# Altium schematic sheet МногоИзменений.SchDoc
size 839 x 594 mm; Origin: Eagle; GateName_1: G$1; SymbolName_1: SEEEDSTUDIO-SCH-FRAME-BIG; LibraryName: moudle-new; DeviceSetName: SEEEDSTUDIO-SCH-FRAME-BIG; Sheet: Sheet:; SeeedStudio: Seeed Studio; Design: Design:; Check: Check:; Vision: Vision:; CC-BY-SA: CC-BY-SA; SheetNumber: 1; SheetTotal: 2; PageSetup: Record=PageOptions|CenterHorizontal=True|CenterVertical=True|PrintScale=0.94|XCorrection=1.00|YCorrection=1.00|PrintKind=1|BorderSize=5000000|LeftOffset=0|BottomOffset=0|Orientation=1|PaperLength=1000|PaperWidth=1000|Scale=100|PaperSource=7|PrintQuality=-4|MediaType=1|DitherType=10|PaperKind=A4|PrintScaleMode=1; ГОСТ 1: ГОСТ 2.104-2006 Глава 6, Форма 1; ГОСТ 2: ГОСТ 2.701-2008 Таблица 1, Таблица 2; ГОСТ 3: ГОСТ 2.301-68; ГОСТ 4: ГОСТ 2.302-68; DocumentName: Sheet1.SCHDOC
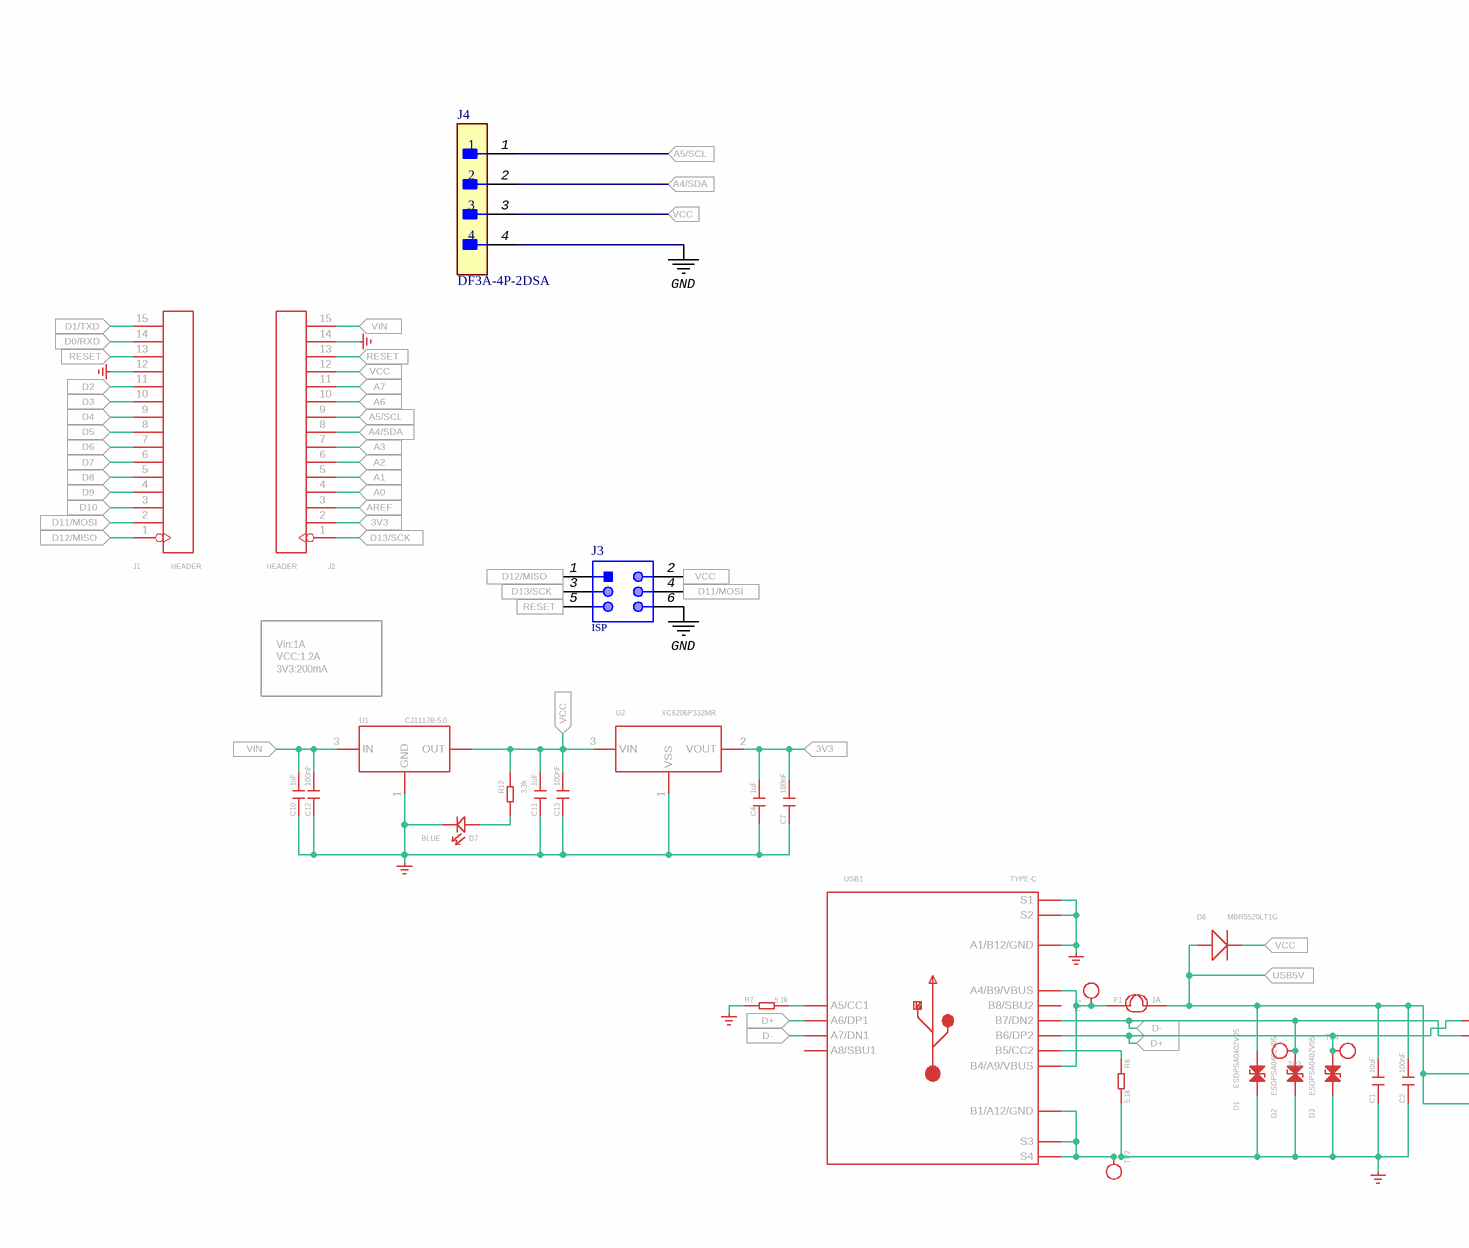
[diagram p0: МногоИзменений.SchDoc, top left]
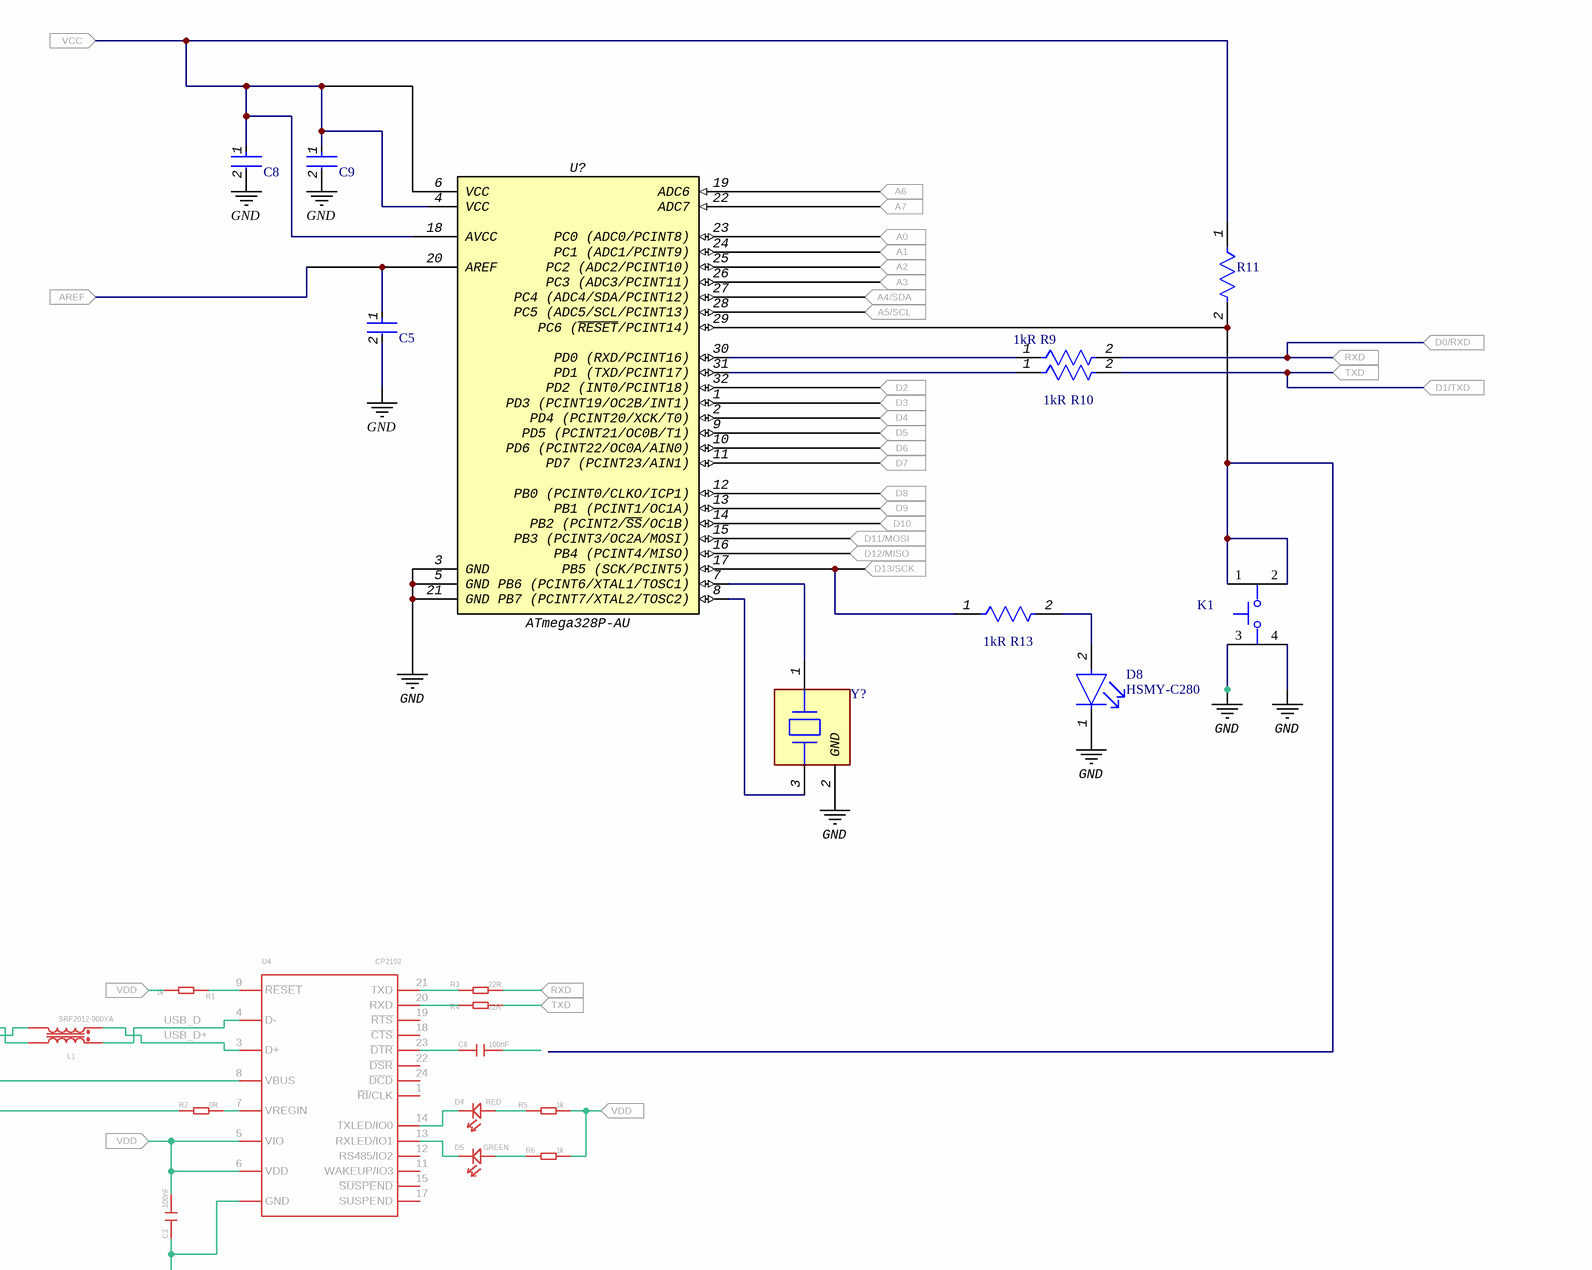
[diagram p1: МногоИзменений.SchDoc, top right]
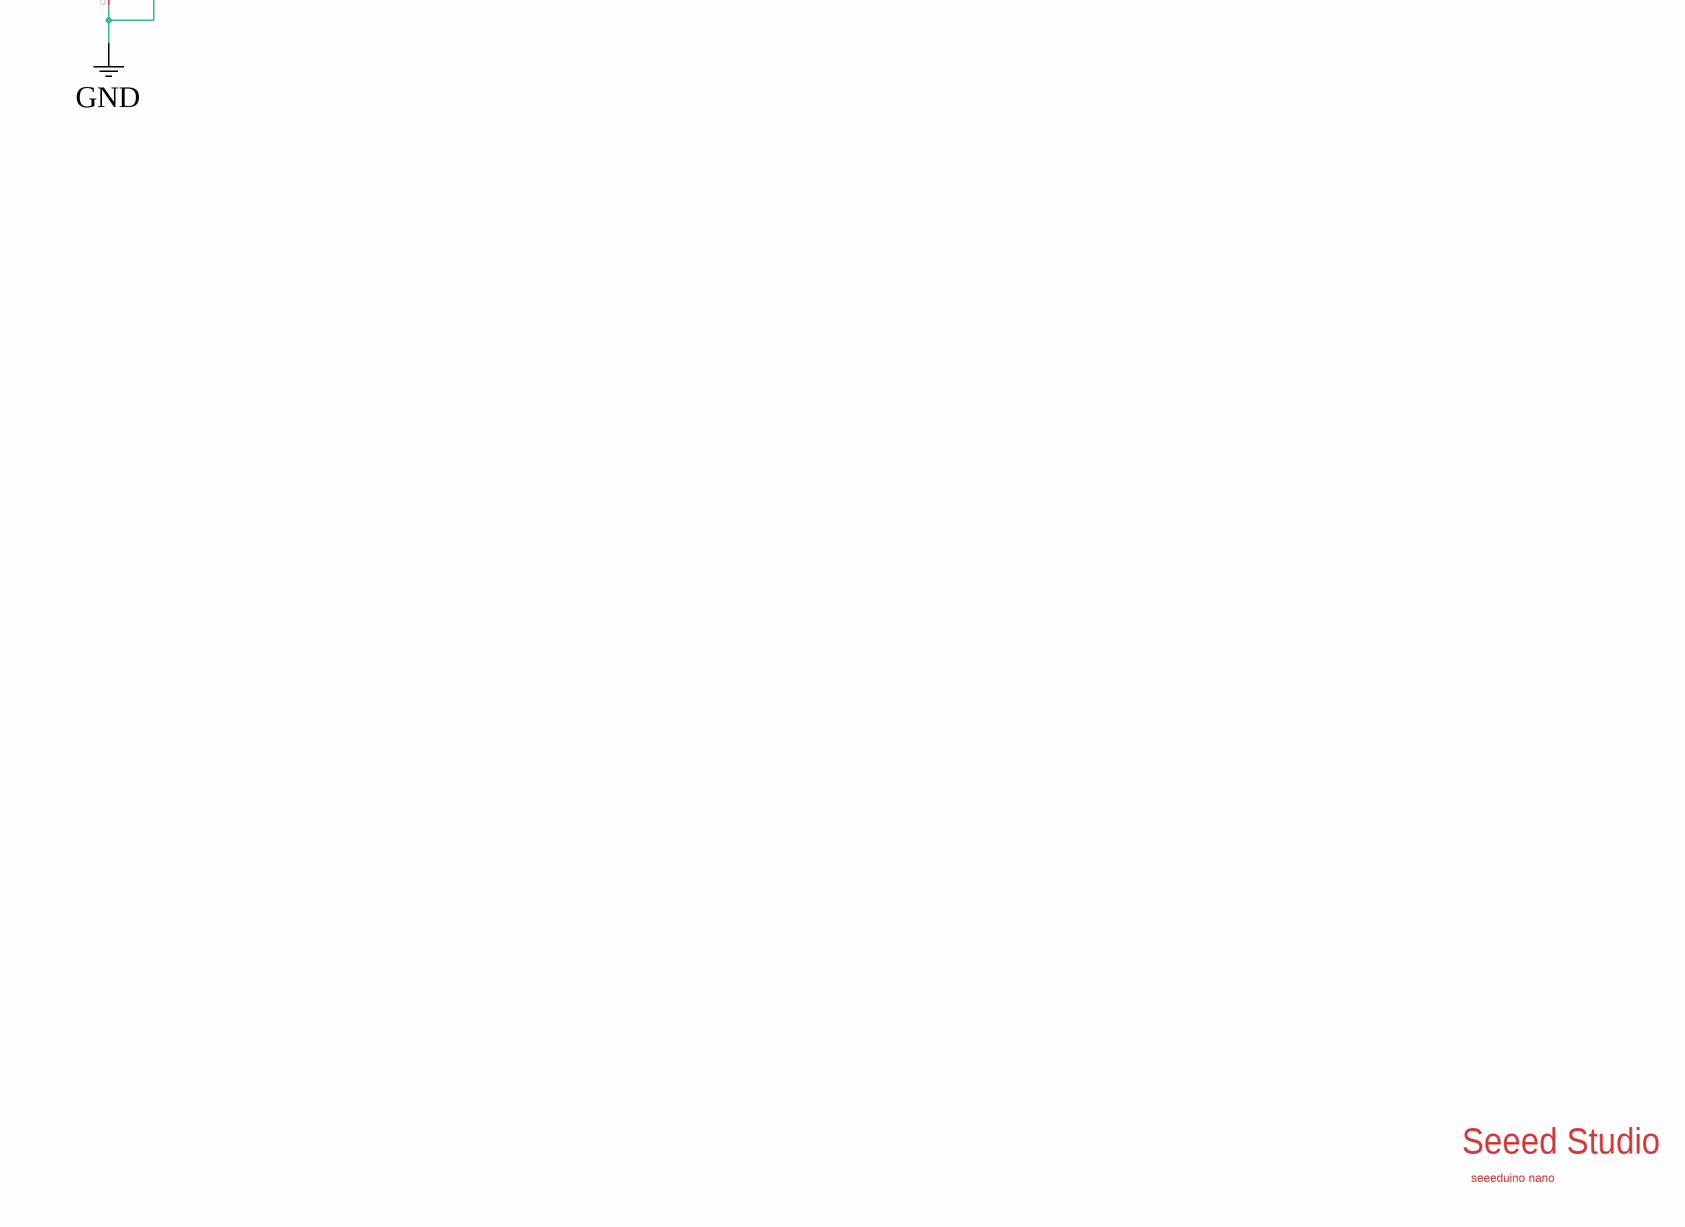
[diagram p2: МногоИзменений.SchDoc, bottom right]

## Parts
C1  10uF  [C0603]
C2  100nF  [C0603]
C3  100nF  [C0603]
C4  1uF  [C0603]
C5  CL10B104JO8NNND  [FP-CL10-IPC_C]  (value not drawn)
C6  100nF  [C0603]
C7  100nF  [C0603]
C8  CL10B104JO8NNND  [FP-CL10-IPC_C]  (value not drawn)
C9  CL10B104JO8NNND  [FP-CL10-IPC_C]  (value not drawn)
C10  1uF  [C0603]
C11  1uF  [C0603]
C12  100nF  [C0603]
C13  100nF  [C0603]
D1  ESDPSA0402V05  [ESD-0402]
D2  ESDPSA0402V05  [ESD-0402]
D3  ESDPSA0402V05  [ESD-0402]
D4  RED  [LED-0402]
D5  GREEN  [LED-0402]
D6  MBR0520LT1G  [SOD123-2.7X1.6]
D7  BLUE  [LED-0402]
D8  HSMY-C280  [FP-HSMY-C280-MFG]
F1  1A  [F1206]
G1  GND_POWER  (value not drawn)
G2  GND_POWER  (value not drawn)
G5  GND_POWER  (value not drawn)
G7  GND_POWER  (value not drawn)
G9  GND_POWER  (value not drawn)
G10  GND_POWER  (value not drawn)
J1  HEADER  [H15-2.54]
J2  HEADER  [H15-2.54]
J3  ISP  [61300621121]
J4  DF3A-4P-2DSA  [FP-DF3A-4P-2DSA-MFG]
K1  SKRAAKE010  [FP-SKRAAKE010-MFG]  (value not drawn)
L1  SRF2012-900YA  [INT4-0.85-2X1.25X1.2MM]
R1  1k  [R0603]
R2  0R  [R0603]
R3  22R  [R0603]
R4  22R  [R0603]
R5  1k  [R0603]
R6  1k  [R0603]
R7  5.1k  [R0603]
R8  5.1k  [R0603]
R9  Resistance: 1kR  [FP-RK73B1J-IPC_C]  (hidden comment: RK73B1JTTD102J)
R10  Resistance: 1kR  [FP-RK73B1J-IPC_C]  (hidden comment: RK73B1JTTD102J)
R11  RT0603DRE0710KL  [FP-RT0603-IPC_C]  (value not drawn)
R12  3.3k  [R0603]
R13  Resistance: 1kR  [FP-RK73B1J-IPC_C]  (hidden comment: RK73B1JTTD102J)
TP1  TEST  [TP-D45MIL]  (value not drawn)
TP2  TEST  [TP-D45MIL]  (value not drawn)
TP3  TEST  [TP-D45MIL]  (value not drawn)
TP4  TEST  [TP-D45MIL]  (value not drawn)
U1  CJ1117B-5.0  [SOT-223]
U2  XC6206P332MR  [SOT-23]
U4  CP2102  [QFN24G-0.5-4X4MM]
U?  ATmega328P-AU  [32A_L]
USB1  TYPE-C  [USB2.0-TYPE-C]
Y?  CSTCE20M0V53-R0  [FP-CSTCE_V-MFG]  (value not drawn)

## Ports
3V3 (in), A0 (in), A1 (in), A2 (in), A3 (in), A4/SDA (in), A5/SCL (in), A6 (in), A7 (in), AREF (in), D0/RXD (in), D1/TXD (in), D2 (in), D3 (in), D4 (in), D5 (in), D6 (in), D7 (in), D8 (in), D9 (in), D10 (in), D11/MOSI (in), D12/MISO (in), D13/SCK (in), D+ (in), D- (in), RESET (in), RXD (in), TXD (in), USB5V (in), VCC (in), VDD (in), VIN (in)

## Nets
GND: C3.2 C5.2 C8.2 C9.2 D8.1(C) J3.6 J4.4 K1.3 K1.4 U4.2_PAD(GND) U?.3(GND) U?.5(GND) U?.21(GND) Y?.2(GND)
3V3: C4.1 C7.1 J2.2 U2.2(VOUT) ; port 3V3
A0: J2.4 U?.23(PC0_(ADC0/PCINT8)) ; port A0
A1: J2.5 U?.24(PC1_(ADC1/PCINT9)) ; port A1
A2: J2.6 U?.25(PC2_(ADC2/PCINT10)) ; port A2
A3: J2.7 U?.26(PC3_(ADC3/PCINT11)) ; port A3
A4/SDA: J2.8 J4.2 U?.27(PC4_(ADC4/SDA/PCINT12)) ; port A4/SDA
A5/SCL: J2.9 J4.1 U?.28(PC5_(ADC5/SCL/PCINT13)) ; port A5/SCL
A6: J2.10 U?.19(ADC6) ; port A6
A7: J2.11 U?.22(ADC7) ; port A7
AREF: C5.1 J2.3 U?.20(AREF) ; port AREF
D0/RXD: J1.14 R3.2 R9.2 ; port RXD, port D0/RXD
D1/TXD: J1.15 R4.2 R10.2 ; port TXD, port D1/TXD
D2: J1.11 U?.32(PD2_(INT0/PCINT18)) ; port D2
D3: J1.10 U?.1(PD3_(PCINT19/OC2B/INT1)) ; port D3
D4: J1.9 U?.2(PD4_(PCINT20/XCK/T0)) ; port D4
D5: J1.8 U?.9(PD5_(PCINT21/OC0B/T1)) ; port D5
D6: J1.7 U?.10(PD6_(PCINT22/OC0A/AIN0)) ; port D6
D7: J1.6 U?.11(PD7_(PCINT23/AIN1)) ; port D7
D8: J1.5 U?.12(PB0_(PCINT0/CLKO/ICP1)) ; port D8
D9: J1.4 U?.13(PB1_(PCINT1/OC1A)) ; port D9
D10: J1.3 U?.14(PB2_(PCINT2/~{SS}/OC1B)) ; port D10
D11/MOSI: J1.2 J3.4 U?.15(PB3_(PCINT3/OC2A/MOSI)) ; port D11/MOSI
D12/MISO: J1.1 J3.1 U?.16(PB4_(PCINT4/MISO)) ; port D12/MISO
D13/SCK: J2.1 J3.3 R13.1 U?.17(PB5_(SCK/PCINT5)) ; port D13/SCK
D+: D3.2 L1.3 TP4.T USB1.A6(A6/DP1) USB1.B6(B6/DP2) ; port D+
D-: D2.2 L1.2 TP3.T USB1.A7(A7/DN1) USB1.B7(B7/DN2) ; port D-
RESET: J1.13 J2.13 J3.5 ; port RESET
USB5V: C1.1 C2.1 D1.2 D6.1(+) F1.2 R2.1 U4.8(VBUS) ; port USB5V
USB_D: L1.1 U4.4(D-)
USB_D+: L1.4 U4.3(D+)
VCC: C8.1 C9.1 C11.1 C13.1 D6.2(-) J2.12 J3.2 J4.3 R11.1 R12.1 U1.2_TER(OUT) U2.3(VIN) U?.4(VCC) U?.6(VCC) U?.18(AVCC) ; port VCC
VDD: C3.1 R1.1 R5.2 R6.2 U4.5(VIO) U4.6(VDD) ; port VDD
VIN: C10.1 C12.1 J2.15 U1.3(IN) ; port VIN
NetC1_2: C1.2 C2.2 D1.1 D2.1 D3.1 G2.?1(GND) R8.2
NetC4_2: C4.2 C7.2 C10.2 C11.2 C12.2 C13.2 D7.- G7.?1(GND) U1.1(GND) U2.1(VSS)
NetC6_2: C6.2 U4.23(~{DTR})
NetD4_+: D4.+ R5.1
NetD4_-: D4.- U4.14(TXLED/IO0)
NetD5_+: D5.+ R6.1
NetD5_-: D5.- U4.13(RXLED/IO1)
NetD7_+: D7.+ R12.2
NetD8_2: D8.2(A) R13.2
NetF1_1: F1.1 TP1.T USB1.A4_B9(A4/B9/VBUS) USB1.B4_A9(B4/A9/VBUS)
NetG1_?1: G1.?1(GND) USB1.A1_B12(A1/B12/GND) USB1.S1_S5(S1) USB1.S2_S6(S2)
NetG5_?1: G5.?1(GND) R7.1
NetG9_?1: G9.?1(GND) J2.14
NetG10_?1: G10.?1(GND) J1.12
NetK1_1: K1.1 K1.2 R11.2 U?.29(PC6_(~{RESET}/PCINT14))
NetR1_2: R1.2 U4.9(~{RESET})
NetR2_2: R2.2 U4.7(VREGIN)
NetR3_1: R3.1 U4.21(TXD)
NetR4_1: R4.1 U4.20(RXD)
NetR7_2: R7.2 USB1.A5(A5/CC1)
NetR8_1: R8.1 USB1.B5(B5/CC2)
NetR9_1: R9.1 U?.30(PD0_(RXD/PCINT16))
NetR10_1: R10.1 U?.31(PD1_(TXD/PCINT17))
NetTP2_T: TP2.T USB1.B1_A12(B1/A12/GND) USB1.S3 USB1.S4
NetU?_7: U?.7(PB6_(PCINT6/XTAL1/TOSC1)) Y?.1(Input)
NetU?_8: U?.8(PB7_(PCINT7/XTAL2/TOSC2)) Y?.3(Output)

Not connected (* = marked no-connect by the designer): C6 1; U4 1(~{RI}/CLK) 11(WAKEUP/IO3) 12(RS485/IO2) 15(~{SUSPEND}) 17(SUSPEND) 18(~{CTS}) 19(~{RTS}) 22(~{DSR}) 24(~{DCD}); USB1 A8(A8/SBU1) B8(B8/SBU2)

## Notes on the sheet
- Vin:1A
  VCC:1.2A
  3V3:200mA
- Seeed Studio
- seeeduino nano
- Перв.примен.
- Справ.№
- Подп. и дата
- Инв.№ дубл.
- Взам.инв.№
- Подп.и дата
- Изм.
- Лист
- № докум.
- Подп.
- Дата
- Лит.
- Масштаб
- Масса
- Разраб.
- Пров.
- Т.контр.
- Схема электрическая структурная
- Листов
- Инв.№ подл.
- Н.контр.
- Утв.
- Копировал
- Формат  A1

## Library data of the parts
C1 C2 = CAP-0603: Ceramic Capacitors; GateName_1: C; DeviceName: -0603; DeviceSetName: CAP; SymbolName_1: C; LibraryName: Discrete-new
C3 C4 C6 C7 C10-C13 = C*-0603: Ceramic Capacitors; GateName_1: C; DeviceName: -0603; DeviceSetName: C*; SymbolName_1: C; LibraryName: Discrete-small
C5 C8 C9 = CMP-13271-003283-1: Cap Ceramic 100nF 16V X7R ±5% Pad SMD 0603 +125°C T/R; Material: Ceramic; Max Operating Temperature: 125°C; Lead Free: Lead Free; Radiation Hardening: No; Mount: Surface Mount; Voltage Rating: 16V; Height: 0.8mm; Min Operating Temperature: -55°C; Voltage Rating (DC): 16V; Tolerance: 5%; Width: 0.031inch; Packaging: Tape and Reel; Capacitance: 100nF; Depth: 0.8mm; Case/Package: 0603; Package Quantity: 10000; Length: 1.6mm; Thickness: 0.035inch; Dielectric: X7R
D1-D3 = D-ESD-2P-DOUBLE-0402: GateName_1: G$1; DeviceName: -0402; SymbolName_1: D-ESD-2P-DOUBLE; LibraryName: Discrete-new; DeviceSetName: D-ESD-2P-DOUBLE
D4 D5 D7 = LED-0402: GateName_1: LED; DeviceName: -0402; SymbolName_1: LED; LibraryName: Discrete-new; DeviceSetName: LED
D6 = D*'MBR0520LT1': GateName_1: D; SymbolName_1: DIODE; DeviceSetName: D*; DeviceName: 'MBR0520LT1'; LibraryName: Discrete-smallsmall
D8 = CMP-18399-000021-1: LED YELLOW DIFFUSED SMD; Number of LEDs: 1; Lens Color: White; Reverse Voltage: 5V; Power Dissipation: 52mW; Luminous Intensity: 8mcd; Wavelength: 586nm; Lens Style: Rectangular; Viewing Angle: 130°; Forward Voltage: 2.1V; Test Current: 20mA; Color: Yellow; REACH SVHC: No SVHC; Illumination Color: Yellow; Lens Transparency: Diffused; Radiation Hardening: No; Number of Pins: 2; Mount: Surface Mount; Min Operating Temperature: -30°C; Max Operating Temperature: 85°C; Max Power Dissipation: 52mW; Package Quantity: 4000; Packaging: Tape and Reel; Case/Package: 0402; Lead Free: Lead Free; Length: 1mm; Number of Elements: 1; Case Code (Metric): 1005; Height: 0.4mm; Dominant Wavelength: 586nm; Case Code (Imperial): 0402; Depth: 0.5mm; Power Rating: 52mW; Width: 0.5mm; Contact Plating: Gold; Forward Current: 20mA
F1 = FUSE'1206': GateName_1: F; SymbolName_1: FUSE; DeviceName: '1206'; LibraryName: Discrete-new; DeviceSetName: FUSE
G1 G2 G5 G7 G9 G10 = GND_POWER: GateName_1: G$1; SymbolName_1: GND_POWER; LibraryName: Power or GND; DeviceSetName: GND_POWER
J1 J2 = HEADER-15P'2.54': Header 15Standard 15-pin 0.1" header. Use with straight break away headers (SKU : PRT-00116), right angle break away headers (PRT-00553), swiss pins (PRT-00743), machine pins (PRT-00117), and female headers (PRT-00115).; GateName_1: G$1; DeviceName: '2.54'; SymbolName_1: HEADER-15P; LibraryName: Connector-new; DeviceSetName: HEADER-15P
J3 = CMP-1502-01072-1: THT Vertical Pin Header WR-PHD, Pitch 2.54 mm, Dual Row, 6 pins; Manufacturer: Wurth Elektronik; Contact Resistance: 20mOhm; Withstanding Voltage: 500VAC; Pin Number: 6; Gender: Male; Pitch: 2.54mm; Working Voltage: 250VAC; Rated Current: 3A; Packaging: Bag; Row Number: Dual; Manufacturer URL: http://www.we-online.de; Part Number: 61300621121; Operating Temperature: -40to105degC; Mounting Technology: THT; Package Reference: 61300621121; Datasheet URL: https://katalog.we-online.de/em/datasheet/6130xx21121.pdf; Orientation: Vertical; Publisher: WurthElektronik
J4 = CMP-11610-000039-1: CONN HEADER VERT 4POS 2MM; Gender: Male; Voltage Rating: 250V; Current Rating: 3A; Number of Positions: 4; Insulation Resistance: 1GR; Connector Type: Male Pin; Contact Plating: Tin; Termination: Through Hole; Number of Rows: 1; Pitch: 2mm; Length: 10mm; Radiation Hardening: No; Insulation Material: Nylon; Contact Gender: Male; Housing Color: Black; Orientation: Straight; Contact Material: Brass; Lead Free: Lead Free; Housing Material: Polyamide; Mount: Through Hole; Color: Black; Packaging: Bulk; Height: 5mm; Package Quantity: 100; Contact Type: Male Pin; RoHS Compliant: Yes; Number of Contacts: 4; Series: DF3
K1 = CMP-24311-000004-1: ALPS ALPINE - - Tactile Switch, SKRA Series, Top Actuated, Surface Mount, Round Button, 245 gf, 50mA at 12VDC; Illumination Type: Illuminated; Contact Resistance: 100mR; Max Voltage Rating (DC): 12V; Actuator Length: 0.9mm; Throw Configuration: SPST; Operating Force: 2.45N; Actuator Color: White; Mechanical Life: 100000Cycles; Actuator Type: STEM; Packaging: Tape and Reel; Depth: 6.8mm; Case/Package: SMD/SMT; Package Quantity: 3000; Max Operating Temperature: 85°C; Termination: J-Bend; Color: White; Contact Current Rating: 50mA; Radiation Hardening: No; Current Rating: 50mA; Lead Free: Lead Free; Min Operating Temperature: -30°C; Electrical Life: 100000Cycles; RoHS Compliant: Yes; Orientation: Straight; Series: SKRA; Mount: Surface Mount; Max Current Rating: 50mA; Voltage Rating (DC): 12V; REACH SVHC: No SVHC
L1 = INDUCTOR-COMMON-MODE-SRF2012-900YA: GateName_1: G$1; SymbolName_1: INDUCTOR-COMMON-MODE; DeviceName: -SRF2012-900YA; LibraryName: Discrete-new; DeviceSetName: INDUCTOR-COMMON-MODE
R1-R8 R12 = R*-0603: GateName_1: R; DeviceName: -0603; DeviceSetName: R*; SymbolName_1: R; LibraryName: Discrete-small
R9 R10 R13 = CMP-2000-01850-2: RES 1K OHM 5% 1/8W 0603; Power Rating: 100mW; Voltage Rating: 50V; Temperature Coefficient: 200ppm/°C; Case Code (Metric): 1608; Military Standard: Not; Case Code (Imperial): 0603; Termination: SMD/SMT; Package Quantity: 5000; Number of Pins: 2; Voltage Rating (DC): 50V; Construction: Rectangular; Length: 1.6mm; Resistance Tolerance: 5%; Mount: Surface Mount; Case/Package: 0603; Min Operating Temperature: -55°C; Max Operating Temperature: 155°C; Technology: THICK FILM; Series: RK73B; Tolerance: 5%; Depth: 0.8mm; Packaging: Tape and Reel; RoHS Compliant: Yes; Height: 0.45mm; Width: 0.8mm; Resistor Type: Thick Film; Lead Free: Lead Free
R11 = CMP-2000-04608-2: RES SMD 10K OHM 0.5% 1/10W 0603; Manufacturer: Yageo; Tolerance: 0.005; Temperature Coefficient: 50 ppm/°C; Voltage Rating: 75V; Value: 10KΩ; Power Rating: 0.1W; Temperature Range Low: -55°C; ComponentLink2Description: Datasheet; RoHS: TRUE; Manufacturer Part Number: RT0603DRE0710KL; Device Class L1: Passive Components; Octopart: https://octopart.com/rt0603dre0710kl-yageo-1185844; Mouser Description: Thin Film Resistors - SMD 10K ohm 0.5% 1/10W; Automotive: No; Device Class L2: Resistors; Device Class L3: Chip SMD Resistors; Footprint Url: http://www.yageo.com/exep/pages/download/literatures/PYu-R_Mount_10.pdf; Temperature Range High: +155°C; Series: RT; Package: RT0603; Resistance: 10KΩ; Category: Res; Temperature: -55°C to +155°C; Height: 0.55mm; ComponentLink2URL: http://www.yageo.com/documents/recent/PYu-RT_1-to-0.01_RoHS_L_9.pdf; Lead Free: Yes; Composition: Thin Film; Digikey Description: RES SMD 10K OHM 0.5% 1/10W 0603; Ipc Land Pattern Name: RESC16080X45
TP1-TP4 = TEST-POINT'4545': PARTNO: DNP; GateName_1: TP; DeviceName: '4545'; SymbolName_1: TEST-POINT; LibraryName: Discrete-new; DeviceSetName: TEST-POINT
U1 = PMIC-CJ*1117S: Low Drop Fixed And Adjustable Positive Voltage Regulators http://www.datasheetcatalog.org/datasheet/SGSThomsonMicroelectronics/mXuqtqv.pdf; GateName_1: G$1; DeviceName: S; SymbolName_1: PMIC-CJ*1117; LibraryName: IC-new; DeviceSetName: PMIC-CJ*1117
U2 = PMIC-XC6206PMR: LOW ESR Cap.Compatible Positive Voltage Regulators; GateName_1: G$1; DeviceName: MR; SymbolName_1: PMIC-XC6206P; LibraryName: IC-new; DeviceSetName: PMIC-XC6206P
U4 = CONVERTER-CP2102N(QFN24): GateName_1: G$1; SymbolName_1: CONVERTER-CP2102N(QFN24); LibraryName: IC-new; DeviceSetName: CONVERTER-CP2102N(QFN24)
U? = CMP-0095-00269-2: 8-bit AVR Microcontroller, 32KB Flash, 1KB EEPROM, 2KB SRAM, 32-pin TQFP, Industrial Grade (-40°C to 85°C); PackageDescription: 32-Lead, 7x7x1.0 mm Body, 0.8mm Lead Pitch, Thin Profile Plastic Quad Flat Package (TQFP); DatasheetVersion: revD, May-2011; RevisionNote: DatasheetVersion & PackageVersion updated. URLs added.; ComponentLink1URL: http://www.atmel.com/; ComponentLink2Description: ATmega48A/48PA/88A/88PA/168A/168PA/328/328P Datasheet; Code_JEDEC: MS-026-ABA; ComponentLink1Description: Manufacturer URL; PackageReference: 32A; ComponentLink3Description: ATmega48A/48PA/88A/88PA/168A/168PA/328/328P Summary; ComponentLink2URL: http://www.atmel.com/dyn/resources/prod_documents/doc8271.pdf; PackageVersion: revC, Oct-2010; ComponentLink3URL: http://www.atmel.com/dyn/resources/prod_documents/8271S.pdf
USB1 = USB2.0-TYPE-C: GateName_1: USB; SymbolName_1: USB2.0-TYPE-C; LibraryName: Connector-new; DeviceSetName: USB2.0-TYPE-C
Y? = CMP-06057-000013-1: CERAMIC RES 20.0000MHZ 15PF SMD; Self Resonant Frequency: 20MHz; Frequency Stability: 0.3%; Tolerance: 0.5%; Impedance: 40R; Height: 0.039inch; Package Quantity: 3000; Capacitance: 15pF; Mount: Surface Mount; Length: 0.126inch; Load Capacitance: 15pF; Resistor Type: Ceramic; Width: 0.051inch; Termination: SMD/SMT; Frequency Tolerance: 0.5%; Case/Package: SMD/SMT; Contact Plating: Gold; Lead Free: Lead Free; Number of Pins: 3; Packaging: Tape and Reel; Min Operating Temperature: -20°C; REACH SVHC: No SVHC; Max Operating Temperature: 80°C; Frequency: 20MHz